# Altium project floor_lamp_dht.PrjPcb
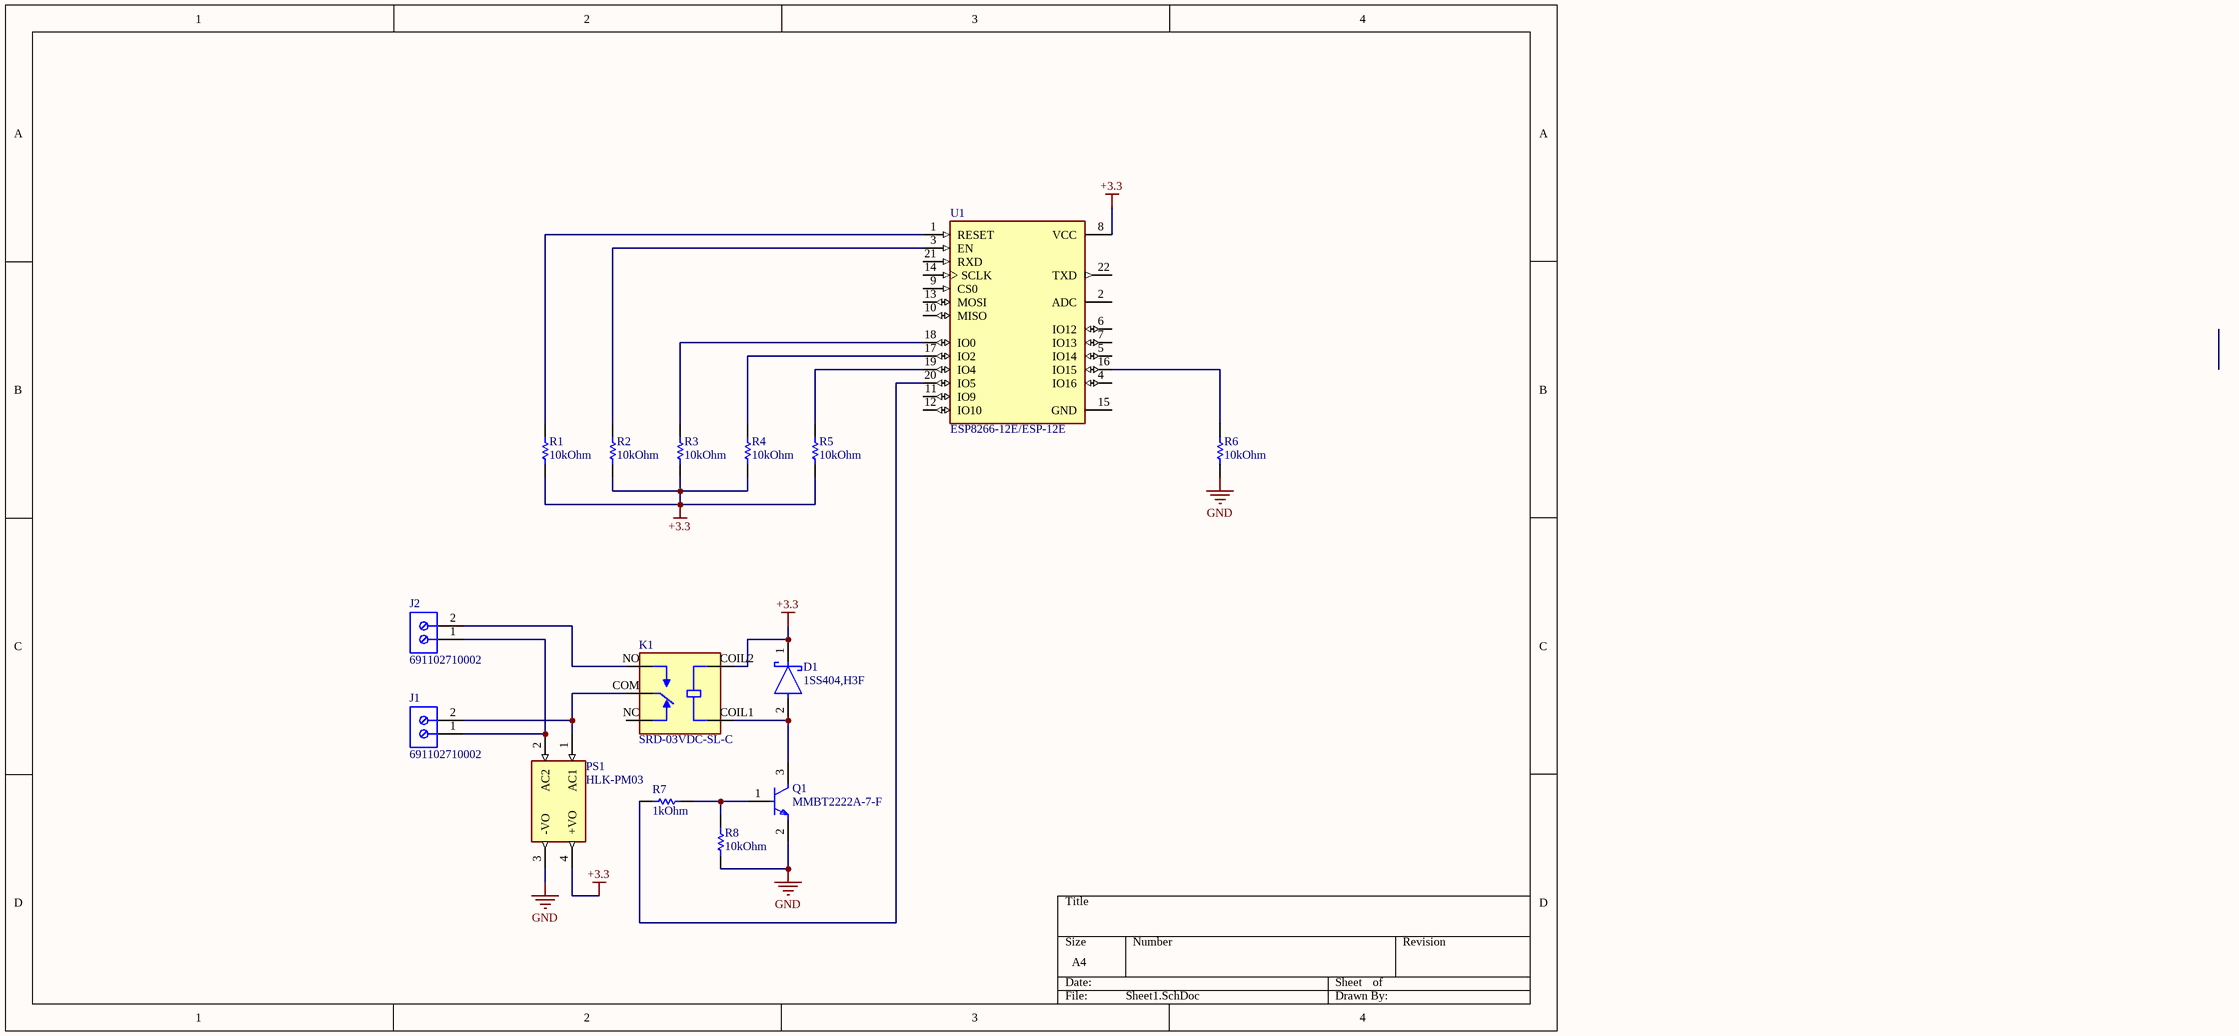
[diagram p0: Sheet1.SchDoc]
1 sheet, 15 parts. Net scope: global (net labels, ports and power ports of the same name join across sheets).
Board file: PCB2.PcbDoc

## Sheet Sheet1.SchDoc
size A4; SheetNumber: 1; SheetTotal: 1

### Parts
D1  1SS404,H3F  [FP-SOD-323-MFG]
J1  691102710002  [691102710002]
J2  691102710002  [691102710002]
K1  SRD-03VDC-SL-C  [RELAY_SRD-03VDC-SL-C]
PS1  HLK-PM03  [CONV_HLK-PM03]
Q1  MMBT2222A-7-F  [FP-SOT23-IPC_A]
R1  10kOhm  [RESC1609X50X30ML10T20]
R2  10kOhm  [RESC1609X50X30ML10T20]
R3  10kOhm  [RESC1609X50X30ML10T20]
R4  10kOhm  [RESC1609X50X30ML10T20]
R5  10kOhm  [RESC1609X50X30ML10T20]
R6  10kOhm  [RESC1609X50X30ML10T20]
R7  1kOhm  [RESC1609X50X30ML10T20]
R8  10kOhm  [RESC1609X50X30ML10T20]
U1  ESP8266-12E/ESP-12E  [XCVR_ESP8266-12E/ESP-12E]

### Nets
+3.3: D1.1(C) K1.COIL2 PS1.4(+VO) R1.1 R2.1 R3.1 R4.1 R5.1 U1.8(VCC)
GND: PS1.3(-VO) Q1.2(E) R6.1 R8.1
NetD1_2: D1.2(A) K1.COIL1 Q1.3(C)
NetJ1_1: J1.1 J2.1 PS1.2(AC2)
NetJ1_2: J1.2 K1.COM PS1.1(AC1)
NetJ2_2: J2.2 K1.NO
NetQ1_1: Q1.1(B) R7.2 R8.2
NetR1_2: R1.2 U1.1(RESET)
NetR2_2: R2.2 U1.3(EN)
NetR3_2: R3.2 U1.18(IO0)
NetR4_2: R4.2 U1.17(IO2)
NetR5_2: R5.2 U1.19(IO4)
NetR6_2: R6.2 U1.16(IO15)
NetR7_1: R7.1 U1.20(IO5)

Not connected (* = marked no-connect by the designer): K1 NC; U1 2(ADC) 4(IO16) 5(IO14) 6(IO12) 7(IO13) 9(CS0) 10(MISO) 11(IO9) 12(IO10) 13(MOSI) 14(SCLK) 15(GND) 21(RXD) 22(TXD)

### Library data of the parts
D1 = CMP-35905-000002-1: DIODE SCHOTTKY 20V 300MA USC; Max Repetitive Reverse Voltage (Vrrm): 25V; Element Configuration: Single; Mount: Surface Mount; Max Reverse Voltage (DC): 20V; Forward Current: 300mA; Packaging: Tape and Reel; Case/Package: SOD; Max Operating Temperature: 100°C; Min Operating Temperature: -40°C; Contact Plating: Tin; Average Rectified Current: 300mA
J1 J2 = CMP-1502-03258-2: NexarPartId: 8917706; Number of Levels: 1; Number of Positions Per Level: 2; Current: 15A; Voltage: 300V; Pitch: 5.0038mm; Plating: Steel; Stripping Length: -6mm; Wire Gauge (Min): 14AWG; Wire Gauge (Max): 22AWG; Length: 7.5mm; Contact Material: Brass; Contact Plating: Tin; Packaging: Box; Number of Pins: 2; Voltage Rating: 300V; Termination: Screw; Number of Contacts: 2; Color: Blue; Current Rating: 15A; Mount: Through Hole; Max Operating Temperature: 105°C; Min Operating Temperature: -40°C; REACH SVHC: Unknown; Height: 13.4mm; Width: 11.2mm; Housing Material: Nylon; RoHS: Compliant; Wire/Cable Gauge: 22AWG; Lead Pitch: 5mm
K1 = SRD-03VDC-SL-C: MF: {'manufacturer': u'Songle Relay'}; Package: None; Price: None; Value: *; MP: SRD-03VDC-SL-C; Availability: Unavailable
PS1 = HLK-PM03: MF: {'manufacturer': u'Hi-link'}; Package: None; Price: None; Value: *; MP: HLK-PM03; Availability: Unavailable
Q1 = CMP-1693-00003-4: TRANS NPN 40V 0.6A SMD SOT23-3; Number of Elements: 1; Frequency: 300MHz; Max Collector Current: 600mA; Collector Base Voltage (VCBO): 75V; Current: 1A; Element Configuration: Single; Power Dissipation: 350mW; hFE Min: 100; Collector Emitter Saturation Voltage: 1V; Max Power Dissipation: 300mW; Emitter Base Voltage (VEBO): 6V; Voltage: 40V; Collector Emitter Breakdown Voltage: 40V; Width: 1.4mm; Polarity: NPN; Termination: SMD/SMT; Max Operating Temperature: 150°C; Transition Frequency: 300MHz; Contact Plating: Tin; Mount: Surface Mount; Max Frequency: 300MHz; Case/Package: SOT-23; Gain Bandwidth Product: 300MHz; Lead Free: Lead Free; Collector Emitter Voltage (VCEO): 40V; Radiation Hardening: No; Voltage Rating (DC): 40V; Height: 1mm; Max Breakdown Voltage: 40V; Packaging: Tape and Reel; Length: 3.05mm; Min Operating Temperature: -55°C; Weight: 0.000282oz; Current Rating: 600mA; REACH SVHC: No SVHC; Package Quantity: 3000; Continuous Collector Current: 600mA; Number of Pins: 3
R1-R8 = CMP-2000-03837-1: Manufacturer: Vishay Dale; Part Number: CRCW060310K0FKTB
U1 = ESP8266-12E/ESP-12E: ESP-12E WiFi Module; MF: {'manufacturer': u'AI-Thinker'}; Package: None; Price: None; Value: *; MP: ESP8266-12E/ESP-12E; Availability: Unavailable